# Altium schematic sheet PICO核心.SchDoc
size A3
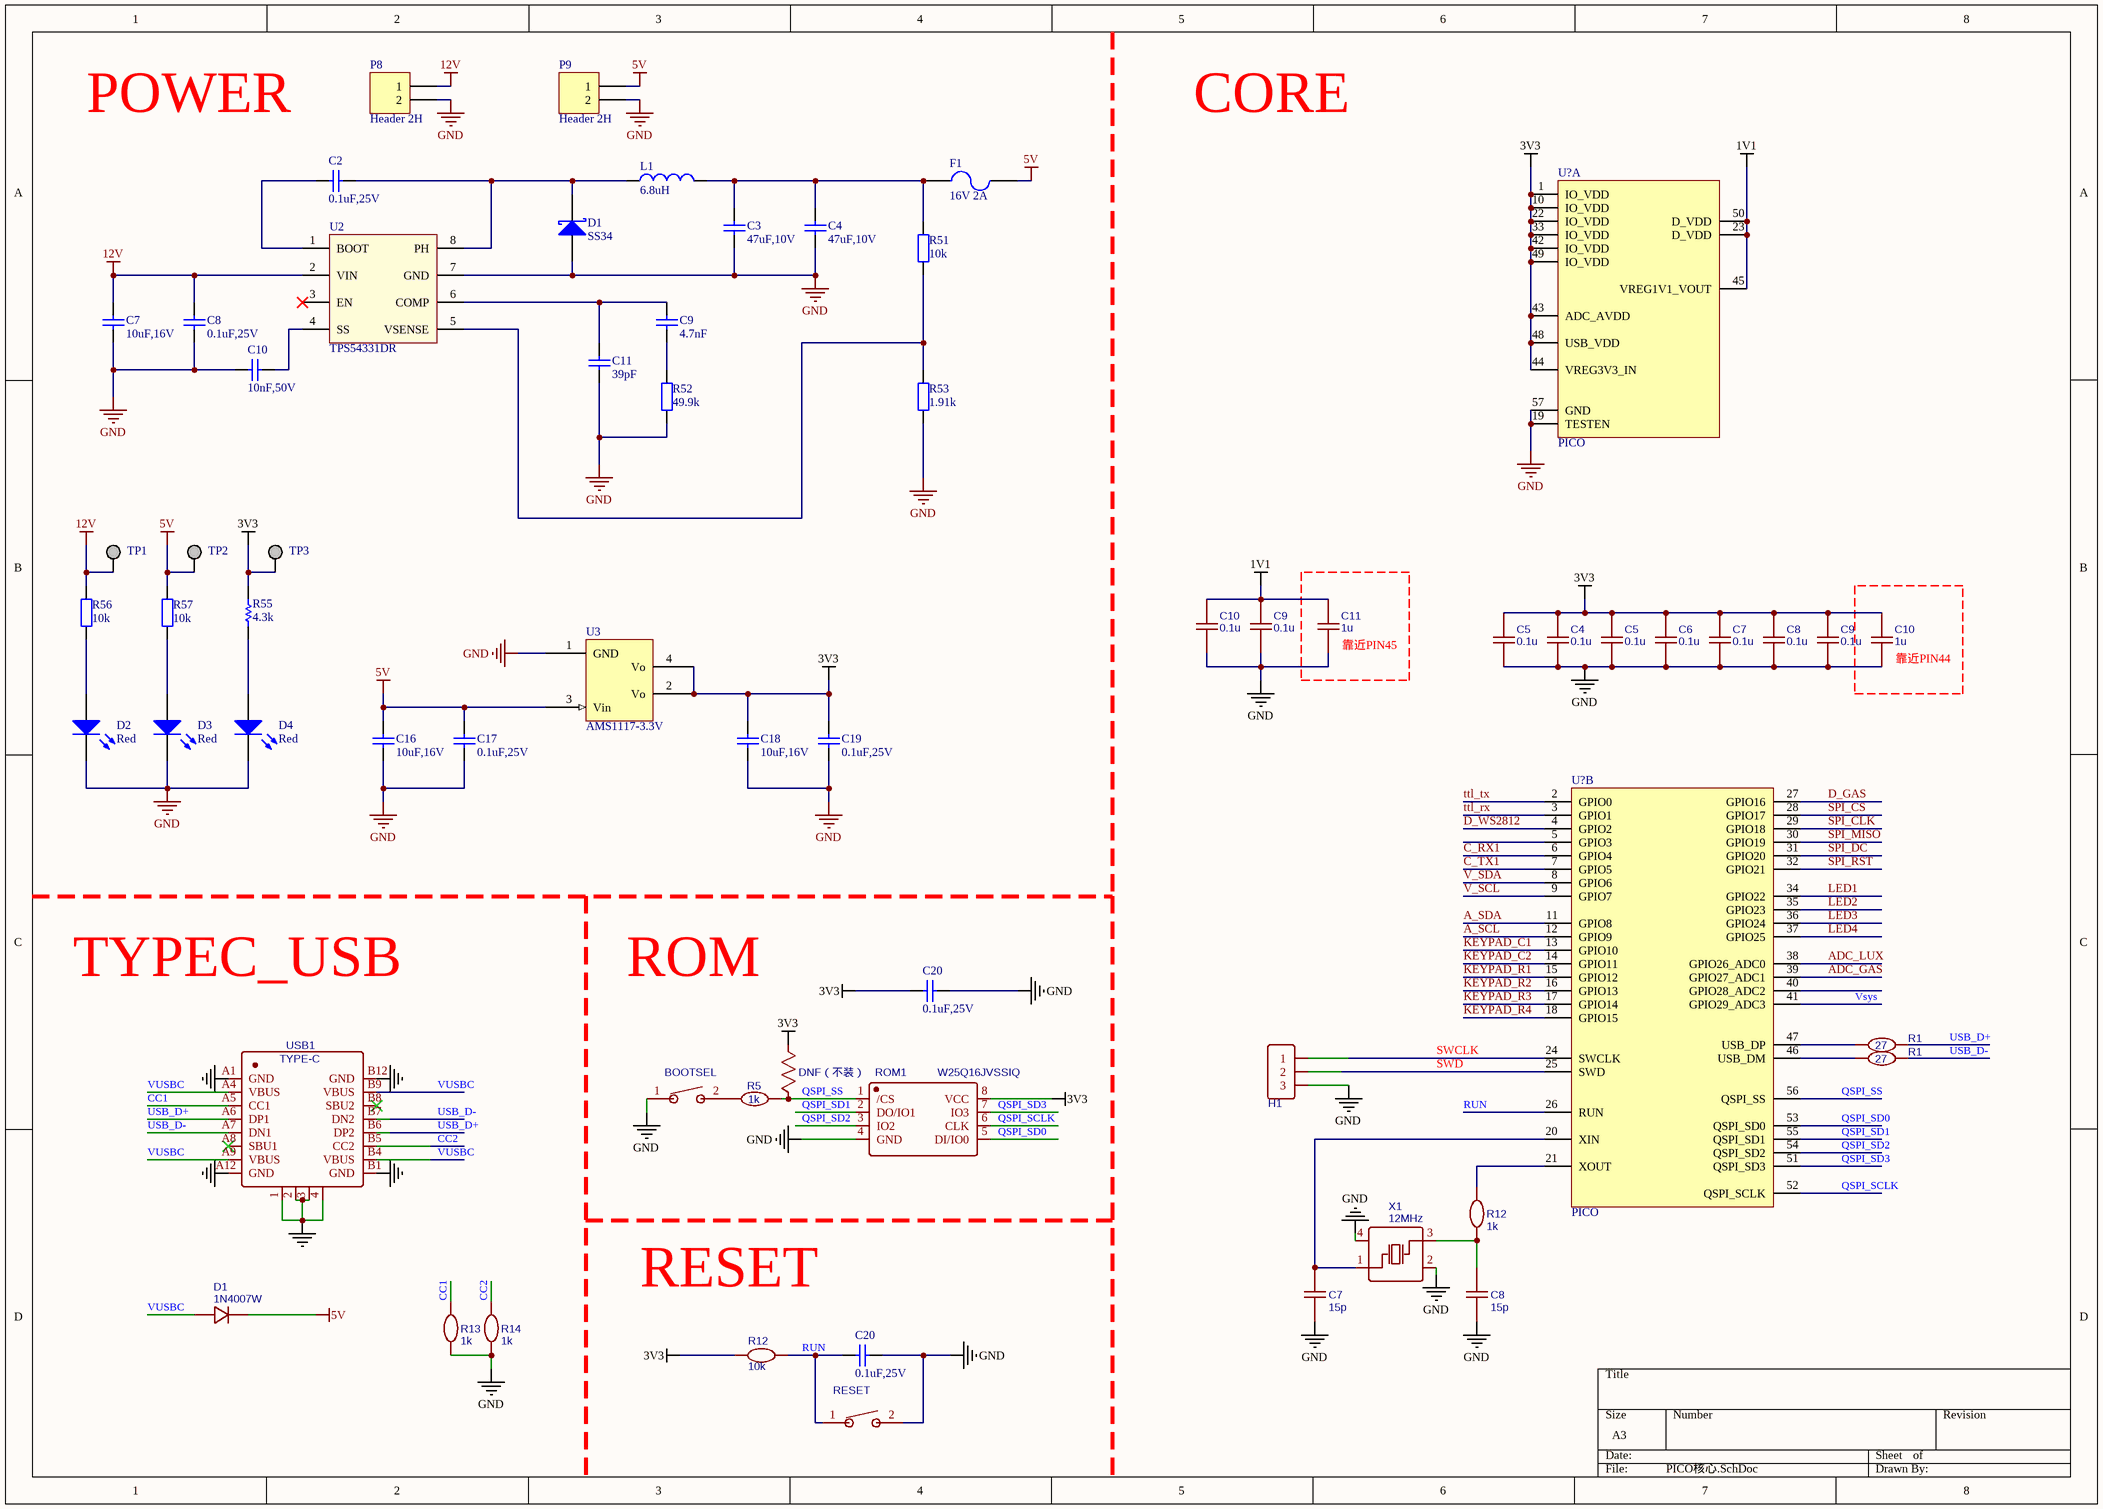
[diagram p0: PICO核心.SchDoc]

## Parts
(Parts that share a designator on the sheet are numbered #1, #2 ... from top to bottom, then left to right.)
BOOTSEL  TSA343G00-250J2  [SW-SMD_L4.0-W2.9-LS5.0]  (value not drawn)
C2  value 0.1uF,25V  [0603_C]  (hidden comment: Cap)
C3  value 47uF,10V  [1206_C]  (hidden comment: Cap)
C4#1  value 47uF,10V  [1206_C]  (hidden comment: Cap)
C4#2  0.1u  [C0603 NSK]
C5#1  0.1u  [C0603 NSK]
C5#2  0.1u  [C0603 NSK]
C6  0.1u  [C0603 NSK]
C7#1  value 10uF,16V  [0603_C]  (hidden comment: Cap)
C7#2  0.1u  [C0603 NSK]
C7#3  15p  [C0603 NSK]
C8#1  value 0.1uF,25V  [0603_C]  (hidden comment: Cap)
C8#2  0.1u  [C0603 NSK]
C8#3  15p  [C0603 NSK]
C9#1  4.7nF  [0603_C]
C9#2  0.1u  [C0603 NSK]
C9#3  0.1u  [C0603 NSK]
C10#1  value 10nF,50V  [0603_C]  (hidden comment: Cap)
C10#2  0.1u  [C0603 NSK]
C10#3  1u  [C0603 NSK]
C11#1  39pF  [0603_C]
C11#2  1u  [C0603 NSK]
C16  value 10uF,16V  [0603_C]  (hidden comment: Cap)
C17  value 0.1uF,25V  [0603_C]  (hidden comment: Cap)
C18  value 10uF,16V  [0603_C]  (hidden comment: Cap)
C19  value 0.1uF,25V  [0603_C]  (hidden comment: Cap)
C20#1  value 0.1uF,25V  [0603_C]  (hidden comment: Cap)
C20#2  value 0.1uF,25V  [0603_C]  (hidden comment: Cap)
D1#1  value SS34  [DO-214AC]  (hidden comment: Diode Schottky)
D1#2  1N4007W  [SOD-123 NSK]
D2  value Red  [0805_LED]  (hidden comment: LED)
D3  value Red  [0805_LED]  (hidden comment: LED)
D4  value Red  [0805_LED]  (hidden comment: LED)
F1  16V 2A  [PTC-1812]
H1  HDR-F-2.54_1x3  [HDR-F-2.54_1X3]  (value not drawn)
L1  6.8uH  [6045_L]
P8  Header 2H  [KF2EDGK3.50H-2P]
P9  Header 2H  [KF2EDGK3.50H-2P]
R1#1  27  [R0603 NSK]
R1#2  27  [R0603 NSK]
R4  DNF（不装）  [R0603 NSK]
R5  1k  [R0603 NSK]
R12#1  1k  [R0603 NSK]
R12#2  10k  [R0603 NSK]
R13  1k  [R0603 NSK]
R14  1k  [R0603 NSK]
R51  value 10k  [0603_R]  (hidden comment: Res)
R52  49.9k  [0603_R]
R53  1.91k  [0603_R]
R55  value 4.3k  [0603_R]  (hidden comment: Res_5%)
R56  value 10k  [0603_R]  (hidden comment: Res)
R57  value 10k  [0603_R]  (hidden comment: Res)
RESET  TSA343G00-250J2  [SW-SMD_L4.0-W2.9-LS5.0]  (value not drawn)
ROM1  W25Q16JVSSIQ  [SOIC-8_L5.3-W5.3-P1.27-LS8.0-BL]
TP1  TP  [TP_H]  (value not drawn)  (no BOM)
TP2  TP  [TP_H]  (value not drawn)  (no BOM)
TP3  TP  [TP_H]  (value not drawn)  (no BOM)
U2  TPS54331DR  [SOIC8E]
U3  value AMS1117-3.3V  [SOT223]  (hidden comment: AMS1117)
U?#1  PICO  (part A of 2)
U?#2  PICO  (part B of 2)
USB1  TYPE-C  [USB-C-SMD_TYC-302-16]
X1  12MHz  [OSC-SMD_4P-L3.2-W2.5-BL-1]

## Blocks framed on the sheet
靠近PIN45: C11#2
靠近PIN44: C10#3

## Nets
1V1: C9#2.1 C10#2.1 C11#2.2 U?#1.23(D_VDD) U?#1.45(VREG1V1_VOUT) U?#1.50(D_VDD)
3V3: C4#2.2 C5#1.1 C5#2.2 C6.2 C7#2.2 C8#2.2 C9#3.2 C10#3.2 C18.2 C19.2 C20#1.2 R4.2 R12#2.2 R55.2 ROM1.8(VCC) TP3.1 U3.2(Vo) U3.4(Vo) U?#1.1(IO_VDD) U?#1.10(IO_VDD) U?#1.22(IO_VDD) U?#1.33(IO_VDD) U?#1.42(IO_VDD) U?#1.43(ADC_AVDD) U?#1.44(VREG3V3_IN) U?#1.48(USB_VDD) U?#1.49(IO_VDD)
5V: C16.2 C17.2 D1#2.1 F1.2 P9.1 R57.2 TP2.1 U3.3(Vin)
12V: C7#1.2 C8#1.2 P8.1 R56.2 TP1.1 U2.2(VIN)
GND: BOOTSEL.1 C3.1 C4#1.1 C4#2.1 C5#1.2 C5#2.1 C6.1 C7#1.1 C7#2.1 C7#3.1 C8#1.1 C8#2.1 C8#3.1 C9#2.2 C9#3.1 C10#1.2 C10#2.2 C10#3.1 C11#1.1 C11#2.1 C16.1 C17.1 C18.1 C19.1 C20#1.1 C20#2.2 D1#1.1(A) D2.2(K) D3.2(K) D4.2(K) H1.3 P8.2 P9.2 R13.1 R14.1 R52.1 R53.1 RESET.2 ROM1.4(GND) U2.7(GND) U3.1(GND) U?#1.19(TESTEN) U?#1.57(GND) USB1.1 USB1.2 USB1.3 USB1.4 USB1.A1(GND) USB1.A12(GND) USB1.B1(GND) USB1.B12(GND) X1.2(GND) X1.4(GND)
A_SCL: U?#2.12(GPIO9)
A_SDA: U?#2.11(GPIO8)
ADC_GAS: U?#2.39(GPIO27_ADC1)
ADC_LUX: U?#2.38(GPIO26_ADC0)
C_RX1: U?#2.6(GPIO4)
C_TX1: U?#2.7(GPIO5)
CC1: R13.2 USB1.A5(CC1)
CC2: R14.2 USB1.B5(CC2)
D_GAS: U?#2.27(GPIO16)
D_WS2812: U?#2.4(GPIO2)
KEYPAD_C1: U?#2.13(GPIO10)
KEYPAD_C2: U?#2.14(GPIO11)
KEYPAD_R1: U?#2.15(GPIO12)
KEYPAD_R2: U?#2.16(GPIO13)
KEYPAD_R3: U?#2.17(GPIO14)
KEYPAD_R4: U?#2.18(GPIO15)
LED1: U?#2.34(GPIO22)
LED2: U?#2.35(GPIO23)
LED3: U?#2.36(GPIO24)
LED4: U?#2.37(GPIO25)
QSPI_SCLK: ROM1.6(CLK) U?#2.52(QSPI_SCLK)
QSPI_SD0: ROM1.5(DI/IO0) U?#2.53(QSPI_SD0)
QSPI_SD1: ROM1.2(DO/IO1) U?#2.55(QSPI_SD1)
QSPI_SD2: ROM1.3(IO2) U?#2.54(QSPI_SD2)
QSPI_SD3: ROM1.7(IO3) U?#2.51(QSPI_SD3)
QSPI_SS: R4.1 R5.2 ROM1.1(/CS) U?#2.56(QSPI_SS)
RUN: C20#2.1 R12#2.1 RESET.1 U?#2.26(RUN)
SPI_CLK: U?#2.29(GPIO18)
SPI_CS: U?#2.28(GPIO17)
SPI_DC: U?#2.31(GPIO20)
SPI_MISO: U?#2.30(GPIO19)
SPI_RST: U?#2.32(GPIO21)
ttl_rx: U?#2.3(GPIO1)
ttl_tx: U?#2.2(GPIO0)
USB_D+: R1#1.2 USB1.A6(DP1) USB1.B6(DP2)
USB_D-: R1#2.2 USB1.A7(DN1) USB1.B7(DN2)
V_SCL: U?#2.9(GPIO7)
V_SDA: U?#2.8(GPIO6)
Vsys: U?#2.41(GPIO29_ADC3)
VUSBC: D1#2.2 USB1.A4(VBUS) USB1.A9(VBUS) USB1.B4(VBUS) USB1.B9(VBUS)
NetBOOTSEL_2: BOOTSEL.2 R5.1
NetC2_1: C2.1 D1#1.2(K) L1.1 U2.8(PH)
NetC2_2: C2.2 U2.1(BOOT)
NetC3_2: C3.2 C4#1.2 F1.1 L1.2 R51.2
NetC7#3_2: C7#3.2 U?#2.20(XIN) X1.1(OSC1)
NetC8#3_2: C8#3.2 R12#1.1 X1.3(OSC2)
NetC9#1_1: C9#1.1 R52.2
NetC9#1_2: C9#1.2 C11#1.2 U2.6(COMP)
NetC10#1_1: C10#1.1 U2.4(SS)
NetD2_1: D2.1(A) R56.1
NetD3_1: D3.1(A) R57.1
NetD4_1: D4.1(A) R55.1
NetH1_1: H1.1 U?#2.24(SWCLK)
NetH1_2: H1.2 U?#2.25(SWD)
NetR1#1_1: R1#1.1 U?#2.47(USB_DP)
NetR1#2_1: R1#2.1 U?#2.46(USB_DM)
NetR12#1_2: R12#1.2 U?#2.21(XOUT)
NetR51_1: R51.1 R53.2 U2.5(VSENSE)

Not connected (* = marked no-connect by the designer): U2 3(EN)*; U?#2 5(GPIO3) 40(GPIO28_ADC2); USB1 A8(SBU1)* B8(SBU2)*

## Notes on the sheet
- POWER
- CORE
- TYPEC_USB
- ROM
- SWCLK
- SWD
- RESET

## Library data of the parts
BOOTSEL RESET = TSA343G00-250J2: BOM_Manufacturer: BRIGHT; Contributor: LCSC; BOM_Supplier: LCSC; BOM_Supplier Part: C354946; BOM_Manufacturer Part: TSA343G00-250J2; BOM_JLCPCB Part Class: Extended Part; spicePre: S; spiceSymbolName: TSA343G00-250J2
C2 C8#1 C17 C19 C20#1 C20#2 = T_Cap_0603_0.1uF_25V_X5R: 贴片电容; Part Typer: X5R; Solder: SMD; Withstand Voltage: 25V; Tolerance: 10%; Schematic Path: X:\Database\Schematic Library.Schlib; Part Number: T_Cap_0603_0.1uF_25V_X5R; LibRef: T_Cap_0603_0.1uF_25V_X5R
C3 C4#1 = T_Cap_1206_47uF_10V_X5R: 贴片电容; Part Typer: X5R; Solder: SMD; Withstand Voltage: 10V; Tolerance: 10%; Schematic Path: X:\Database\Schematic Library.Schlib; Part Number: T_Cap_1206_47uF_10V_X5R; LibRef: T_Cap_1206_47uF_10V_X5R
C4#2 C5#1 C5#2 C6 C7#2 C8#2 C9#2 C9#3 C10#2 C10#3 C11#2 = 0.1u: nameAlias: Value(F); Contributor: LCEDA_Lib; spicePre: C; spiceSymbolName: C_0603_US
C7#1 C16 C18 = T_Cap_0603_10uF_16V_X5R: 贴片电容; Part Typer: X5R; Solder: SMD; Withstand Voltage: 16V; Tolerance: 10%; Schematic Path: X:\Database\Schematic Library.Schlib; Part Number: T_Cap_0603_10uF_16V_X5R; LibRef: T_Cap_0603_10uF_16V_X5R
C7#3 = 15p: nameAlias: Value(F); Contributor: LCEDA_Lib; spicePre: C; spiceSymbolName: C_0603_US
C8#3 = 15p: nameAlias: Value(F); Contributor: LCEDA_Lib; Package Display: No; spicePre: C; spiceSymbolName: C_0603_US
C9#1 C11#1 = Cap
C10#1 = T_Cap_0603_10nF_50V_X7R: 贴片电容; Part Typer: X7R; Solder: SMD; Withstand Voltage: 50V; Tolerance: 10%; Schematic Path: X:\Database\Schematic Library.Schlib; Part Number: T_Cap_0603_10nF_50V_X7R; LibRef: T_Cap_0603_10nF_50V_X7R
D1#1 = T_SS34: 肖特基二极管; Part Number: T_SS34; Solder: SMD; Schematic Path: X:\Database\Schematic Library.Schlib; LibRef: T_SS34
D1#2 = 1N4007W: BOM_Manufacturer: BLUE ROCKET; Contributor: LCEDA_Lib; BOM_Supplier: LCSC; BOM_Supplier Part: C328592; BOM_Manufacturer Part: 1N4007W; spicePre: D; spiceSymbolName: 1N4007W
D2-D4 = T_LED_Red_0805: 红色LED灯; Solder: SMD; Schematic Path: X:\Database\Schematic Library.Schlib; Part Number: T_LED_Red_0805; LibRef: T_LED_Red_0805
F1 = Fuse
H1 = HDR-F-2.54_1x3: Contributor: LCEDA_Lib; BOM_Supplier Part: C146690; BOM_Supplier: LCSC; spicePre: H; spiceSymbolName: HDR-F-2.54_1x3
L1 = Inductor
P8 P9 = Header 2H: Header, 2-Pin, Right Angle; LatestRevisionDate: 17-Jul-2002; LatestRevisionNote: Re-released for DXP Platform.; Publisher: Altium Limited
R1#1 R1#2 = 27: nameAlias: Value(Ω); Contributor: LCEDA_Lib; spicePre: R; spiceSymbolName: R_0603_EU
R4 = DNF（不装）: nameAlias: Value(Ω); Contributor: LCEDA_Lib; spicePre: R; spiceSymbolName: R_0603_US
R5 R12#1 R12#2 R13 R14 = 1k: nameAlias: Value(Ω); Contributor: LCEDA_Lib; spicePre: R; spiceSymbolName: R_0603_EU
R51 R56 R57 = T_Res_0603_10k_1%_1/10W: 贴片电阻; Solder: SMD; Power: 1/10W; Tolerance: 1%; Schematic Path: X:\Database\Schematic Library.Schlib; Part Number: T_Res_0603_10k_1%_1/10W; LibRef: T_Res_0603_10k_1%_1/10W
R52 R53 = Res
R55 = T_Res_0603_4.3k_5%_1/10W: 贴片电阻; Solder: SMD; Power: 1/10W; Tolerance: 5%; Schematic Path: X:\Database\Schematic Library.Schlib; Part Number: T_Res_0603_4.3k_5%_1/10W; LibRef: T_Res_0603_4.3k_5%_1/10W
ROM1 = W25Q16JVSSIQ: BOM_Manufacturer: WINBOND; BOM_Supplier: LCSC; BOM_Manufacturer Part: W25Q16JVSSIQ; BOM_Supplier Part: C82317; BOM_JLCPCB Part Class: Extended Part; spicePre: U; spiceSymbolName: W25Q16JVSSIQ
TP1-TP3 = T_TestPoint_H: 测试点_过孔; Solder: DIP; Schematic Path: X:\Database\Schematic Library.Schlib; Part Number: T_TestPoint_H; LibRef: T_TestPoint_H
U2 = TPS54331: TI, 3A, 3.5-28V, Buck
U3 = T_AMS1117-3.3V: 电源芯片; Solder: SMD; Schematic Path: X:\Database\Schematic Library.Schlib; Part Number: T_AMS1117-3.3V; LibRef: T_AMS1117-3.3V; ComponentLink2Description: Datasheet; ComponentLink2URL: X:\Database\Datasheet\AMS1117.pdf
U?#1 U?#2 = PICO_CORE
USB1 = TYPE-C: BOM_Manufacturer: XUNPU; BOM_Manufacturer Part: TYC-302-16; Contributor: LCSC; Package Display: No; BOM_Supplier: LCSC; BOM_Supplier Part: C381477; spicePre: U; spiceSymbolName: TYC-302-16
X1 = 12MHz: BOM_Manufacturer: YXC; BOM_Manufacturer Part: X322512MLB4SI; nameAlias: Frequency; BOM_Supplier: LCSC; BOM_Supplier Part: C112971; BOM_JLCPCB Part Class: Extended Part; spicePre: X; spiceSymbolName: X322512MLB4SI